# Altium project Relay_Board_V2.0.PrjPcb
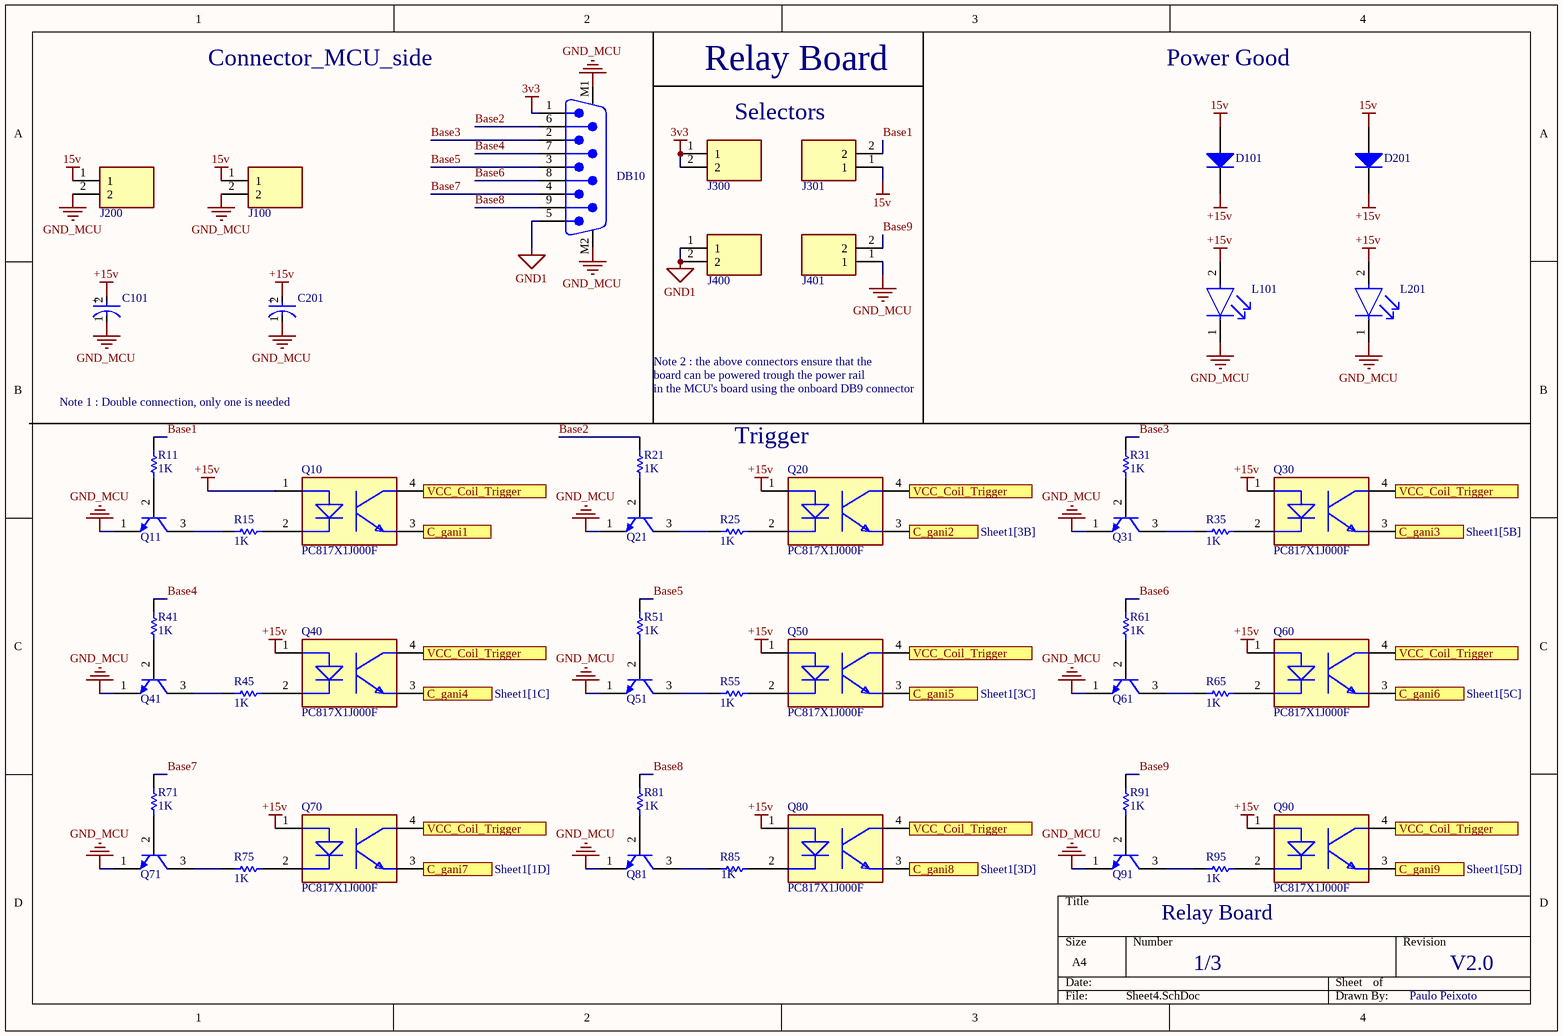
[diagram p0: Sheet4.SchDoc]
3 sheets, 136 parts. Net scope: flat (ports and power ports of the same name join across sheets).
Board file: PCB.PcbDoc
Sheets:
  Sheet4.SchDoc
  Sheet1.SchDoc
  Sheet2.SchDoc

## Sheet Sheet4.SchDoc
size A4; SheetNumber: 1; SheetTotal: 3

### Parts
C101  EEE-FK1H100UR  [FP-FKC-MFG]  (value not drawn)
C201  EEE-FK1H100UR  [FP-FKC-MFG]  (value not drawn)
D101  1N4001-T  [DIOD-DO-41-P-2_V]  (value not drawn)
D201  1N4001-T  [DIOD-DO-41-P-2_V]  (value not drawn)
DB10  618009231221  [618009231221]  (value not drawn)
J100  TB004-508-02BE  [Terminal_TH_2P_3.50]  (value not drawn)
J200  TB004-508-02BE  [Terminal_TH_2P_3.50]  (value not drawn)
J300  TB004-508-02BE  [HEADER_MALE_TH_2P_2.54]  (value not drawn)
J301  TB004-508-02BE  [HEADER_MALE_TH_2P_2.54]  (value not drawn)
J400  TB004-508-02BE  [HEADER_MALE_TH_2P_2.54]  (value not drawn)
J401  TB004-508-02BE  [HEADER_MALE_TH_2P_2.54]  (value not drawn)
L101  TLLG4400  [FP-6_544-5255_01-4-MFG]  (value not drawn)
L201  TLLG4400  [FP-6_544-5255_01-4-MFG]  (value not drawn)
Q10  PC817X1J000F  [FP-PC817X1J000F-MFG]
Q11  PN2222ATF  [FAIR-TO-92-3]  (value not drawn)
Q20  PC817X1J000F  [FP-PC817X1J000F-MFG]
Q21  PN2222ATF  [FAIR-TO-92-3]  (value not drawn)
Q30  PC817X1J000F  [FP-PC817X1J000F-MFG]
Q31  PN2222ATF  [FAIR-TO-92-3]  (value not drawn)
Q40  PC817X1J000F  [FP-PC817X1J000F-MFG]
Q41  PN2222ATF  [FAIR-TO-92-3]  (value not drawn)
Q50  PC817X1J000F  [FP-PC817X1J000F-MFG]
Q51  PN2222ATF  [FAIR-TO-92-3]  (value not drawn)
Q60  PC817X1J000F  [FP-PC817X1J000F-MFG]
Q61  PN2222ATF  [FAIR-TO-92-3]  (value not drawn)
Q70  PC817X1J000F  [FP-PC817X1J000F-MFG]
Q71  PN2222ATF  [FAIR-TO-92-3]  (value not drawn)
Q80  PC817X1J000F  [FP-PC817X1J000F-MFG]
Q81  PN2222ATF  [FAIR-TO-92-3]  (value not drawn)
Q90  PC817X1J000F  [FP-PC817X1J000F-MFG]
Q91  PN2222ATF  [FAIR-TO-92-3]  (value not drawn)
R11  1K  [RESC3216X70X50NL05T20]
R15  1K  [RESC3216X70X50NL05T20]
R21  1K  [RESC3216X70X50NL05T20]
R25  1K  [RESC3216X70X50NL05T20]
R31  1K  [RESC3216X70X50NL05T20]
R35  1K  [RESC3216X70X50NL05T20]
R41  1K  [RESC3216X70X50NL05T20]
R45  1K  [RESC3216X70X50NL05T20]
R51  1K  [RESC3216X70X50NL05T20]
R55  1K  [RESC3216X70X50NL05T20]
R61  1K  [RESC3216X70X50NL05T20]
R65  1K  [RESC3216X70X50NL05T20]
R71  1K  [RESC3216X70X50NL05T20]
R75  1K  [RESC3216X70X50NL05T20]
R81  1K  [RESC3216X70X50NL05T20]
R85  1K  [RESC3216X70X50NL05T20]
R91  1K  [RESC3216X70X50NL05T20]
R95  1K  [RESC3216X70X50NL05T20]

### Ports
C_gani1 (see Sheet1[1B]), C_gani2 (see Sheet1[3B]), C_gani3 (see Sheet1[5B]), C_gani4 (see Sheet1[1C]), C_gani5 (see Sheet1[3C]), C_gani6 (see Sheet1[5C]), C_gani7 (see Sheet1[1D]), C_gani8 (see Sheet1[3D]), C_gani9 (see Sheet1[5D]), VCC_Coil_Trigger (see Sheet1[1A], Sheet1[1C], Sheet1[1D], Sheet1[3A], Sheet1[3C], Sheet1[3D], Sheet1[5A], Sheet1[5C], Sheet1[5D], Sheet2[1A], Sheet2[2A], Sheet4[2B], Sheet4[2C], Sheet4[2D], Sheet4[3B], Sheet4[3C], Sheet4[3D], Sheet4[4B], Sheet4[4C]), VCC_Coil_Trigger (see Sheet1[1A], Sheet1[1C], Sheet1[1D], Sheet1[3A], Sheet1[3C], Sheet1[3D], Sheet1[5A], Sheet1[5C], Sheet1[5D], Sheet2[1A], Sheet2[2A], Sheet4[2B], Sheet4[2C], Sheet4[2D], Sheet4[3B], Sheet4[3C], Sheet4[3D], Sheet4[4B], Sheet4[4D]), VCC_Coil_Trigger (see Sheet1[1A], Sheet1[1C], Sheet1[1D], Sheet1[3A], Sheet1[3C], Sheet1[3D], Sheet1[5A], Sheet1[5C], Sheet1[5D], Sheet2[1A], Sheet2[2A], Sheet4[2B], Sheet4[2C], Sheet4[2D], Sheet4[3B], Sheet4[3C], Sheet4[3D], Sheet4[4C], Sheet4[4D]), VCC_Coil_Trigger (see Sheet1[1A], Sheet1[1C], Sheet1[1D], Sheet1[3A], Sheet1[3C], Sheet1[3D], Sheet1[5A], Sheet1[5C], Sheet1[5D], Sheet2[1A], Sheet2[2A], Sheet4[2B], Sheet4[2C], Sheet4[2D], Sheet4[3B], Sheet4[3C], Sheet4[4B], Sheet4[4C], Sheet4[4D]), VCC_Coil_Trigger (see Sheet1[1A], Sheet1[1C], Sheet1[1D], Sheet1[3A], Sheet1[3C], Sheet1[3D], Sheet1[5A], Sheet1[5C], Sheet1[5D], Sheet2[1A], Sheet2[2A], Sheet4[2B], Sheet4[2C], Sheet4[2D], Sheet4[3B], Sheet4[3D], Sheet4[4B], Sheet4[4C], Sheet4[4D]), VCC_Coil_Trigger (see Sheet1[1A], Sheet1[1C], Sheet1[1D], Sheet1[3A], Sheet1[3C], Sheet1[3D], Sheet1[5A], Sheet1[5C], Sheet1[5D], Sheet2[1A], Sheet2[2A], Sheet4[2B], Sheet4[2C], Sheet4[2D], Sheet4[3C], Sheet4[3D], Sheet4[4B], Sheet4[4C], Sheet4[4D]), VCC_Coil_Trigger (see Sheet1[1A], Sheet1[1C], Sheet1[1D], Sheet1[3A], Sheet1[3C], Sheet1[3D], Sheet1[5A], Sheet1[5C], Sheet1[5D], Sheet2[1A], Sheet2[2A], Sheet4[2B], Sheet4[2C], Sheet4[3B], Sheet4[3C], Sheet4[3D], Sheet4[4B], Sheet4[4C], Sheet4[4D]), VCC_Coil_Trigger (see Sheet1[1A], Sheet1[1C], Sheet1[1D], Sheet1[3A], Sheet1[3C], Sheet1[3D], Sheet1[5A], Sheet1[5C], Sheet1[5D], Sheet2[1A], Sheet2[2A], Sheet4[2B], Sheet4[2D], Sheet4[3B], Sheet4[3C], Sheet4[3D], Sheet4[4B], Sheet4[4C], Sheet4[4D]), VCC_Coil_Trigger (see Sheet1[1A], Sheet1[1C], Sheet1[1D], Sheet1[3A], Sheet1[3C], Sheet1[3D], Sheet1[5A], Sheet1[5C], Sheet1[5D], Sheet2[1A], Sheet2[2A], Sheet4[2C], Sheet4[2D], Sheet4[3B], Sheet4[3C], Sheet4[3D], Sheet4[4B], Sheet4[4C], Sheet4[4D])

### Nets
3v3: DB10.1 J300.1 J300.2
15v: D101.1(A) D201.1(A) J100.1 J200.1 J301.1
+15v: C101.2(A) C201.2(A) D101.2(K) D201.2(K) L101.2(A) L201.2(A) Q10.1(A) Q20.1(A) Q30.1(A) Q40.1(A) Q50.1(A) Q60.1(A) Q70.1(A) Q80.1(A) Q90.1(A)
GND1: DB10.5 J400.1 J400.2
GND_MCU: C101.1(C) C201.1(C) DB10.M1 DB10.M2 J100.2 J200.2 J401.1 L101.1(C) L201.1(C) Q11.1(E) Q21.1(E) Q31.1(E) Q41.1(E) Q51.1(E) Q61.1(E) Q71.1(E) Q81.1(E) Q91.1(E)
Base1: J301.2 R11.2
Base2: DB10.6 R21.2
Base3: DB10.2 R31.2
Base4: DB10.7 R41.2
Base5: DB10.3 R51.2
Base6: DB10.8 R61.2
Base7: DB10.4 R71.2
Base8: DB10.9 R81.2
Base9: J401.2 R91.2
NetC301_2: Q10.4(C) Q20.4(C) Q30.4(C) Q40.4(C) Q50.4(C) Q60.4(C) Q70.4(C) Q80.4(C) Q90.4(C) ; port VCC_Coil_Trigger
NetQ10_2: Q10.2(C) R15.1
NetQ10_3: Q10.3(E) ; port C_gani1
NetQ11_2: Q11.2(B) R11.1
NetQ11_3: Q11.3(C) R15.2
NetQ20_2: Q20.2(C) R25.1
NetQ20_3: Q20.3(E) ; port C_gani2
NetQ21_2: Q21.2(B) R21.1
NetQ21_3: Q21.3(C) R25.2
NetQ30_2: Q30.2(C) R35.1
NetQ30_3: Q30.3(E) ; port C_gani3
NetQ31_2: Q31.2(B) R31.1
NetQ31_3: Q31.3(C) R35.2
NetQ40_2: Q40.2(C) R45.1
NetQ40_3: Q40.3(E) ; port C_gani4
NetQ41_2: Q41.2(B) R41.1
NetQ41_3: Q41.3(C) R45.2
NetQ50_2: Q50.2(C) R55.1
NetQ50_3: Q50.3(E) ; port C_gani5
NetQ51_2: Q51.2(B) R51.1
NetQ51_3: Q51.3(C) R55.2
NetQ60_2: Q60.2(C) R65.1
NetQ60_3: Q60.3(E) ; port C_gani6
NetQ61_2: Q61.2(B) R61.1
NetQ61_3: Q61.3(C) R65.2
NetQ70_2: Q70.2(C) R75.1
NetQ70_3: Q70.3(E) ; port C_gani7
NetQ71_2: Q71.2(B) R71.1
NetQ71_3: Q71.3(C) R75.2
NetQ80_2: Q80.2(C) R85.1
NetQ80_3: Q80.3(E) ; port C_gani8
NetQ81_2: Q81.2(B) R81.1
NetQ81_3: Q81.3(C) R85.2
NetQ90_2: Q90.2(C) R95.1
NetQ90_3: Q90.3(E) ; port C_gani9
NetQ91_2: Q91.2(B) R91.1
NetQ91_3: Q91.3(C) R95.2

### Notes on the sheet
- Connector_MCU_side
- Relay Board
- Power Good
- Selectors
- Note 2 : the above connectors ensure that the
- board can be powered trough the power rail
- (near R11) Note 1 : Double connection, only one is needed
- in the MCU's board using the onboard DB9 connector
- (near Q20) Trigger
- 1/3
- V2.0
- Paulo Peixoto
- (in symbol CMP-05427-000030-1) +

### Library data of the parts
C101 C201 = CMP-05427-000030-1: CAP ALUM 10UF 20% 50V SMD; Impedance: 1.52R; Ripple Current (AC): 85mA; Life (Hours): 2000Hour; Leakage Current: 3uA; Dielectric Material: Aluminium; Length: 5.8mm; Voltage Rating: 50V; Radiation Hardening: No; Max Operating Temperature: 105°C; REACH SVHC: No SVHC; Tolerance: 20%; RoHS Compliant: Yes; Case/Package: Radial; Height: 5.8mm; Voltage: 50V; Diameter: 5mm; Number of Pins: 2; Ripple Current: 85mA; Series: FK; Lead Free: Lead Free; Width: 6.5mm; ESR (Equivalent Series Resistance): 1.52R; Package Quantity: 1000; Construction: Cylindrical; Voltage Rating (DC): 50V; Packaging: Tape and Reel; Height - Seated (Max): 0.228inch; Contact Plating: Tin; Capacitance: 10uF; Min Operating Temperature: -55°C; Termination: SMD/SMT; Material: Aluminium; Mount: Surface Mount
D101 D201 = CMP-0639-00006-2: 1.0 A Rectifier, 15 pF, 50 V, -65 to 150 degC, 2-Pin DO-41 Plastic, RoHS, Tape and Reel; Manufacturer: Diodes Inc; VF (V): 1; CT (pF): 15; Max. IR (uA): 5; VRRM (V): 50; Max. IFSM (A): 30; RoHS: TRUE; Mounting Technology: Through Hole; PartNumber: 1N4001-T; ComponentLink2Description: Datasheet; DatasheetVersion: Rev. 8-2; Operating Temperature Range (degC): -65 to 150; Packing: Tape and Reel; PackageReference: DO-41-P-2; ComponentLink1URL: http://diodes.com/; PackageDescription: 2-Pin Axial Lead, Body 4.635 x 2.36 mm, Lead Spread 25.4 mm; ComponentLink2URL: http://diodes.com/datasheets/ds28002.pdf; Max. Average Rectified Current IO (A): 1; ComponentLink1Description: Manufacturer URL
DB10 = CMP-1502-00284-2: NexarPartId: 22865742; Pitch: 2.77mm; Number of Contacts: 9; Operating Supply Voltage: 125V; Insulation Resistance: 5GΩ; Gender: Male; Contact Resistance: 30mΩ; Current Rating: 3A; Mount: Through Hole; Housing Material: Steel; Contact Plating: Gold; Width: 12.5mm; Insulation Material: PBT; RoHS: Compliant; Depth: 18.5mm; Contact Material: Gold; Max Operating Temperature: 105°C; Min Operating Temperature: -55°C; Termination: SMD/SMT; Height: 12.7mm; Voltage Rating: 125V; Length: 30.8mm; Orientation: Right Angle; Number of Rows: 2; Number of Pins: 9; REACH SVHC: Unknown
J100 J200 = Con_Terminal_2P: Connector; Manufacturer_Name: CUI Devices; Datasheet Link: https://componentsearchengine.com/Datasheets/1/TB004-508-02BE.pdf; Height: 14.1mm; Manufacturer_Part_Number: TB004-508-02BE; Arrow Part Number: TB004-508-02BE; Arrow Price/Stock: https://www.arrow.com/en/products/tb004-508-02be/cui-inc; Mouser Part Number: 490-TB004-508-02BE; Mouser Price/Stock: https://www.mouser.co.uk/ProductDetail/CUI-Devices/TB004-508-02BE?qs=vLWxofP3U2zLwdGzG2tSkA%3D%3D
J300 J301 J400 J401 = Con_Header_2P: Connector; Manufacturer_Name: CUI Devices; Datasheet Link: https://componentsearchengine.com/Datasheets/1/TB004-508-02BE.pdf; Height: 14.1mm; Manufacturer_Part_Number: TB004-508-02BE; Arrow Part Number: TB004-508-02BE; Arrow Price/Stock: https://www.arrow.com/en/products/tb004-508-02be/cui-inc; Mouser Part Number: 490-TB004-508-02BE; Mouser Price/Stock: https://www.mouser.co.uk/ProductDetail/CUI-Devices/TB004-508-02BE?qs=vLWxofP3U2zLwdGzG2tSkA%3D%3D
L101 L201 = CMP-00030-55433990-1: TLLG4400 Led, Pcb, Green, 0.63MCD, 3MM, T-1, 7MA, 1.9V, 565NM, 25DEG, 20V, 20MW, -40; Lens Transparency: Diffused; Dominant Wavelength: 575nm; Test Current: 2mA; Viewing Angle: 50°; Lens Style: Circular, Colored, Diffused, Dome, Round; Number of LEDs: 1; Voltage Rating (DC): 2.4V; Luminous Intensity: 1.2mcd; Depth: 3.2mm; Wavelength: 575nm; Color: Green; Schedule B: 8541402000, 8541402000; RoHS: Compliant; Max Operating Temperature: 100°C; Power Dissipation: 20mW; Height: 4.5mm; Number of Pins: 2; Forward Voltage: 1.9V; NexarPartId: 55433990; Max Power Dissipation: 20mW; Length: 3.2mm; Forward Current: 2mA; Min Operating Temperature: -40°C; Illumination Color: Green; Lens Size: 3mm; Reverse Voltage: 20V; Mount: Through Hole; Case/Package: T; Radiation Hardening: No; Number of Elements: 1; REACH SVHC: Unknown; Lens Color: Green
Q10 Q20 Q30 Q40 Q50 Q60 Q70 Q80 Q90 = CMP-65434-000003-1: OPTOISOLATOR 5KV TRANS 4DIP; Collector Emitter Saturation Voltage: 200mV; Forward Voltage: 1.4V; Power Dissipation: 200mW; Input Current: 20mA; Max Collector Current: 50mA; Collector Emitter Breakdown Voltage: 80V; Rise Time: 18000ns; Number of Elements: 1; Reverse Breakdown Voltage: 6V; Current Transfer Ratio: 600%; Min Operating Temperature: -30°C; Number of Pins: 4; Radiation Hardening: No; Output Current per Channel: 50mA; Case/Package: DIP; Fall Time: 18000ns; Forward Current: 50mA; Isolation Voltage: 5kV; Package Quantity: 2000; Max Operating Temperature: 100°C; Packaging: Sleeve; Max Input Current: 50mA; Output Voltage: 80V; Max Power Dissipation: 200mW; Mount: Through Hole; Number of Channels: 1; Collector Emitter Voltage (VCEO): 80V
Q11 Q21 Q31 Q41 Q51 Q61 Q71 Q81 Q91 = CMP-2000-06911-1: NPN General-Purpose Amplifier, 40 V, -55 to 150 degC, 3-Pin TO-92, RoHS, Tape and Reel; Manufacturer: FairchildSemiconductor; Configuration: Single; Collector-Emitter Saturation Voltage: 1V; Collector- Emitter Voltage VCEO Max: 40V; Unit Weight: 0.008466oz; Maximum DC Collector Current: 1A; DC Collector/Base Gain hfe Min: 100; Emitter- Base Voltage VEBO: 6V; Maximum Power Dissipation: 625mW; DC Current Gain hFE Max: 300; Gain Bandwidth Product fT: 300MHz; Collector- Base Voltage VCBO: 75V; Mounting Style: ThroughHole; Package Description: 3-Pin Transistor Outline Package, Body Dia 4.79 mm, Pitch 2.6 mm; Mounting Technology: ThroughHole; RoHS: Details; Brand: FairchildSemiconductor; Minimum Operating Temperature: -55C; Package / Case: TO-92-3KinkedLead; Package Reference: TO-92; Series: PN2222; Packaging: Reel; Datasheet Version: Rev. 1.1.0, 07/2014; Datasheet URL: https://www.fairchildsemi.com/datasheets/PN/PN2222A.pdf; Maximum Operating Temperature: +150C; Transistor Polarity: NPN; Factory Pack Quantity: 2000; Manufacturer URL: https://www.fairchildsemi.com/; <PCN>: http://www.mouser.com/PCN/3.26.10LTBDFairchild.pdf; Product Category: BipolarTransistors-BJT
R11 R15 R21 R25 R31 R35 R41 R45 R51 R55 R61 R65 R71 R75 R81 R85 R91 R95 = CMP-2003-00541-1: Manufacturer: Panasonic; Part Number: ERJ-8GEY0R00V

## Sheet Sheet1.SchDoc
size B; SheetNumber: 2; SheetTotal: 3
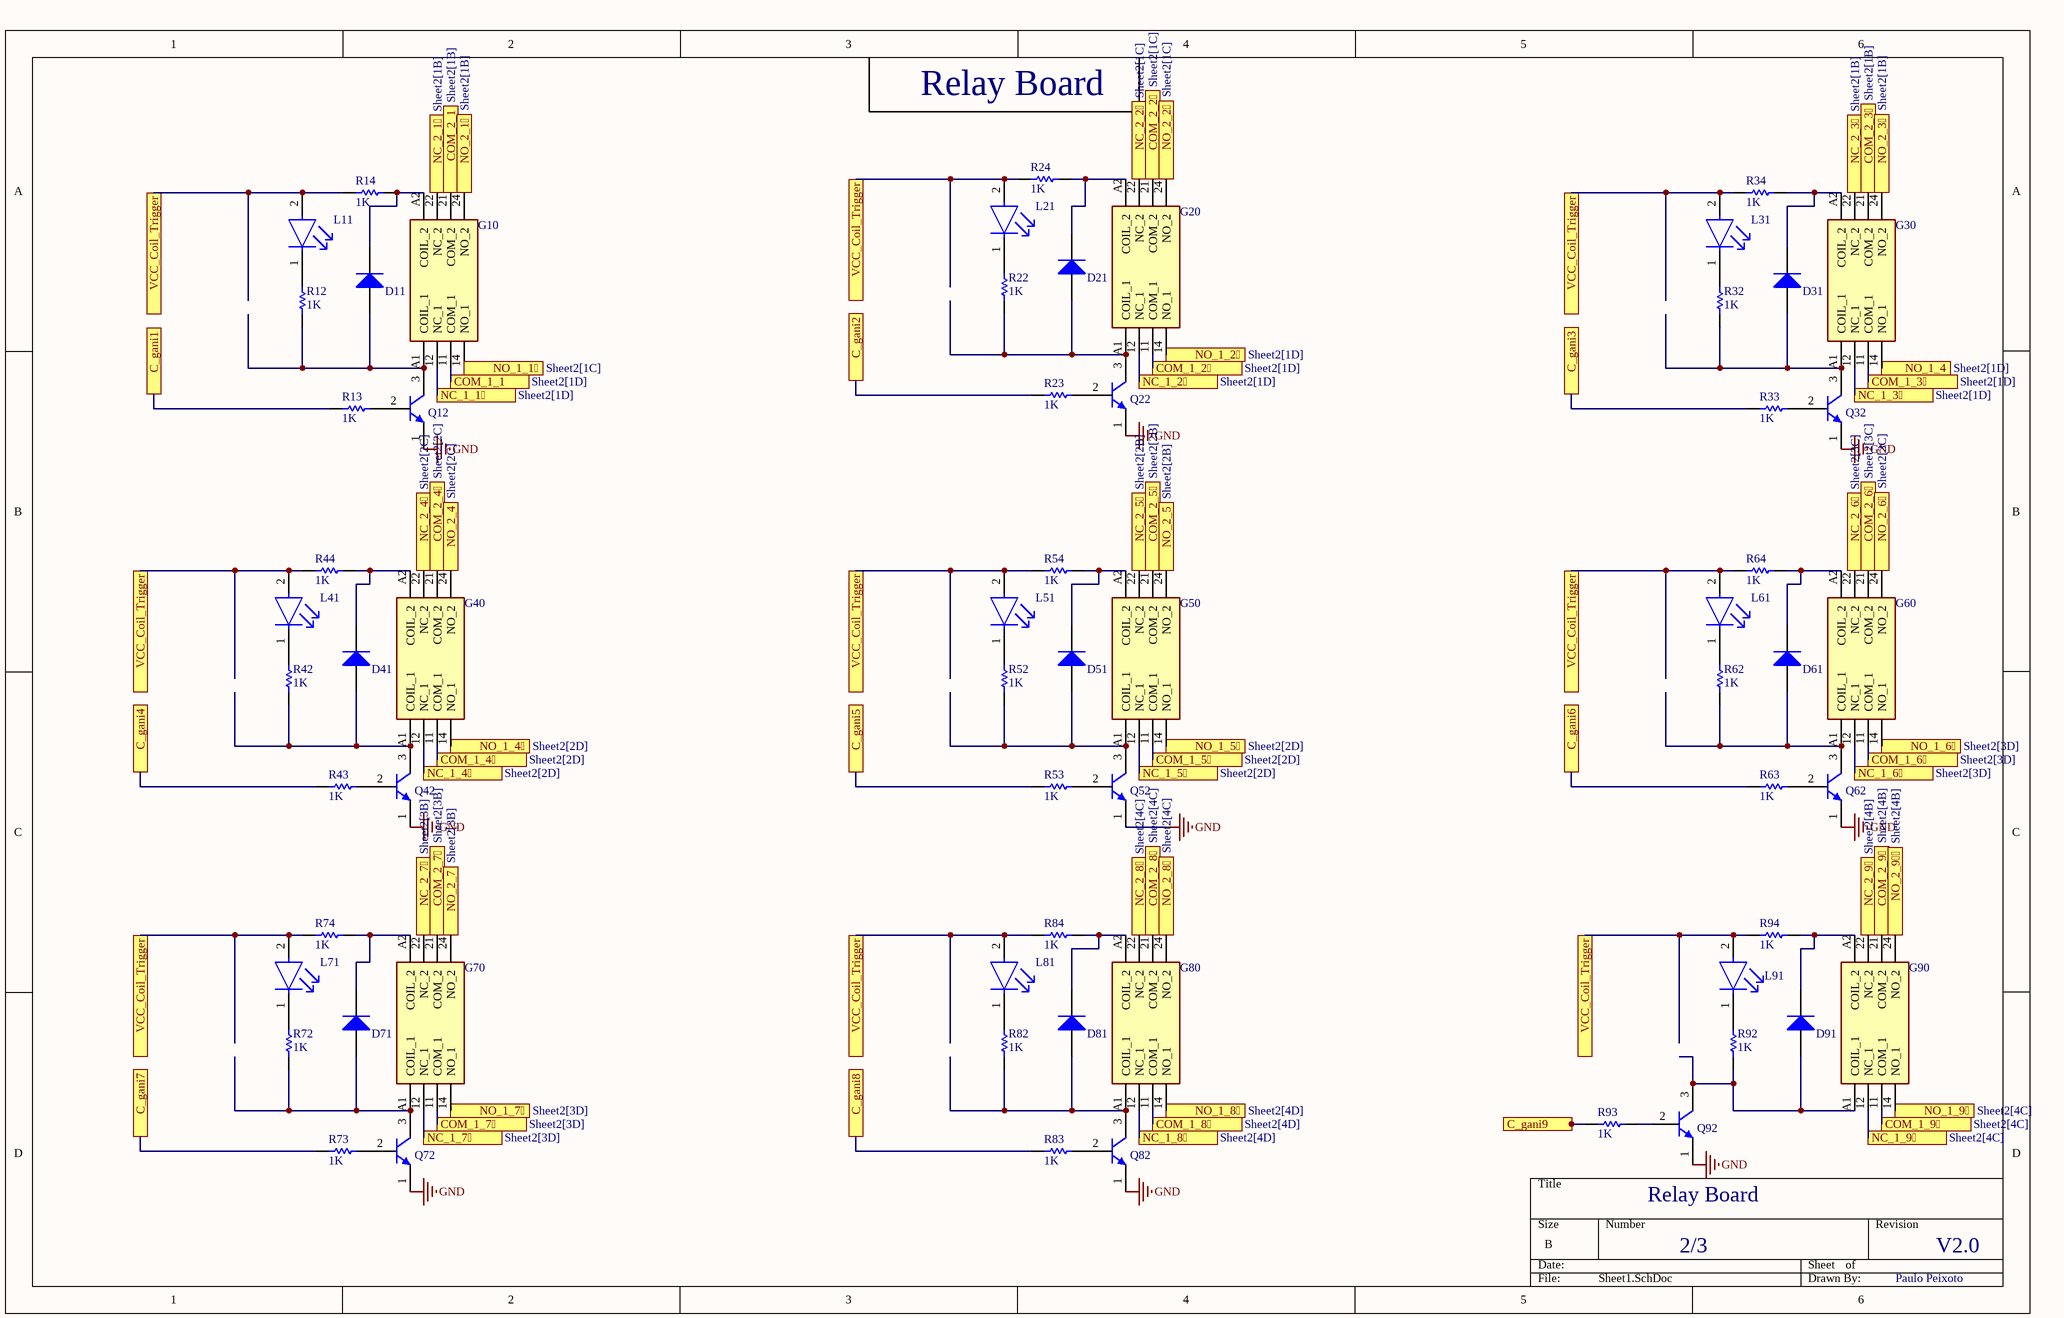
[diagram p1: Sheet1.SchDoc]

### Parts
D11  1N4001-T  [DIOD-DO-41-P-2_V]  (value not drawn)
D21  1N4001-T  [DIOD-DO-41-P-2_V]  (value not drawn)
D31  1N4001-T  [DIOD-DO-41-P-2_V]  (value not drawn)
D41  1N4001-T  [DIOD-DO-41-P-2_V]  (value not drawn)
D51  1N4001-T  [DIOD-DO-41-P-2_V]  (value not drawn)
D61  1N4001-T  [DIOD-DO-41-P-2_V]  (value not drawn)
D71  1N4001-T  [DIOD-DO-41-P-2_V]  (value not drawn)
D81  1N4001-T  [DIOD-DO-41-P-2_V]  (value not drawn)
D91  1N4001-T  [DIOD-DO-41-P-2_V]  (value not drawn)
G10  40.52.9.012.0000  [405290120000]  (value not drawn)
G20  40.52.9.012.0000  [405290120000]  (value not drawn)
G30  40.52.9.012.0000  [405290120000]  (value not drawn)
G40  40.52.9.012.0000  [405290120000]  (value not drawn)
G50  40.52.9.012.0000  [405290120000]  (value not drawn)
G60  40.52.9.012.0000  [405290120000]  (value not drawn)
G70  40.52.9.012.0000  [405290120000]  (value not drawn)
G80  40.52.9.012.0000  [405290120000]  (value not drawn)
G90  40.52.9.012.0000  [405290120000]  (value not drawn)
L11  TLLG4400  [FP-6_544-5255_01-4-MFG]  (value not drawn)
L21  TLLG4400  [FP-6_544-5255_01-4-MFG]  (value not drawn)
L31  TLLG4400  [FP-6_544-5255_01-4-MFG]  (value not drawn)
L41  TLLG4400  [FP-6_544-5255_01-4-MFG]  (value not drawn)
L51  TLLG4400  [FP-6_544-5255_01-4-MFG]  (value not drawn)
L61  TLLG4400  [FP-6_544-5255_01-4-MFG]  (value not drawn)
L71  TLLG4400  [FP-6_544-5255_01-4-MFG]  (value not drawn)
L81  TLLG4400  [FP-6_544-5255_01-4-MFG]  (value not drawn)
L91  TLLG4400  [FP-6_544-5255_01-4-MFG]  (value not drawn)
Q12  PN2222ATF  [FAIR-TO-92-3]  (value not drawn)
Q22  PN2222ATF  [FAIR-TO-92-3]  (value not drawn)
Q32  PN2222ATF  [FAIR-TO-92-3]  (value not drawn)
Q42  PN2222ATF  [FAIR-TO-92-3]  (value not drawn)
Q52  PN2222ATF  [FAIR-TO-92-3]  (value not drawn)
Q62  PN2222ATF  [FAIR-TO-92-3]  (value not drawn)
Q72  PN2222ATF  [FAIR-TO-92-3]  (value not drawn)
Q82  PN2222ATF  [FAIR-TO-92-3]  (value not drawn)
Q92  PN2222ATF  [FAIR-TO-92-3]  (value not drawn)
R12  1K  [RESC3216X70X50NL05T20]
R13  1K  [RESC3216X70X50NL05T20]
R14  1K  [RESC3216X70X50NL05T20]
R22  1K  [RESC3216X70X50NL05T20]
R23  1K  [RESC3216X70X50NL05T20]
R24  1K  [RESC3216X70X50NL05T20]
R32  1K  [RESC3216X70X50NL05T20]
R33  1K  [RESC3216X70X50NL05T20]
R34  1K  [RESC3216X70X50NL05T20]
R42  1K  [RESC3216X70X50NL05T20]
R43  1K  [RESC3216X70X50NL05T20]
R44  1K  [RESC3216X70X50NL05T20]
R52  1K  [RESC3216X70X50NL05T20]
R53  1K  [RESC3216X70X50NL05T20]
R54  1K  [RESC3216X70X50NL05T20]
R62  1K  [RESC3216X70X50NL05T20]
R63  1K  [RESC3216X70X50NL05T20]
R64  1K  [RESC3216X70X50NL05T20]
R72  1K  [RESC3216X70X50NL05T20]
R73  1K  [RESC3216X70X50NL05T20]
R74  1K  [RESC3216X70X50NL05T20]
R82  1K  [RESC3216X70X50NL05T20]
R83  1K  [RESC3216X70X50NL05T20]
R84  1K  [RESC3216X70X50NL05T20]
R92  1K  [RESC3216X70X50NL05T20]
R93  1K  [RESC3216X70X50NL05T20]
R94  1K  [RESC3216X70X50NL05T20]

### Ports
C_gani1 (see Sheet4[2C]), C_gani2 (see Sheet4[3C]), C_gani3 (see Sheet4[4C]), C_gani4 (see Sheet4[2C]), C_gani5 (see Sheet4[3C]), C_gani6 (see Sheet4[4C]), C_gani7 (see Sheet4[2D]), C_gani8 (see Sheet4[3D]), C_gani9 (see Sheet4[4D]), COM_1_1 (see Sheet2[1D]), COM_1_2 (see Sheet2[1D]), COM_1_3 (see Sheet2[1D]), COM_1_4 (see Sheet2[2D]), COM_1_5 (see Sheet2[2D]), COM_1_6 (see Sheet2[3D]), COM_1_7 (see Sheet2[3D]), COM_1_8 (see Sheet2[4D]), COM_1_9 (see Sheet2[4C]), COM_2_1 (see Sheet2[1B]), COM_2_2 (see Sheet2[1C]), COM_2_3 (see Sheet2[1B]), COM_2_4 (see Sheet2[2C]), COM_2_5 (see Sheet2[2B]), COM_2_6 (see Sheet2[3C]), COM_2_7 (see Sheet2[3B]), COM_2_8 (see Sheet2[4C]), COM_2_9 (see Sheet2[4B]), NC_1_1 (see Sheet2[1D]), NC_1_2 (see Sheet2[1D]), NC_1_3 (see Sheet2[1D]), NC_1_4 (see Sheet2[2D]), NC_1_5 (see Sheet2[2D]), NC_1_6 (see Sheet2[3D]), NC_1_7 (see Sheet2[3D]), NC_1_8 (see Sheet2[4D]), NC_1_9 (see Sheet2[4C]), NC_2_1 (see Sheet2[1B]), NC_2_2 (see Sheet2[1C]), NC_2_3 (see Sheet2[1B]), NC_2_4 (see Sheet2[2C]), NC_2_5 (see Sheet2[2B]), NC_2_6 (see Sheet2[3C]), NC_2_7 (see Sheet2[3B]), NC_2_8 (see Sheet2[4C]), NC_2_9 (see Sheet2[4B]), NO_1_1 (see Sheet2[1C]), NO_1_2 (see Sheet2[1D]), NO_1_4 (see Sheet2[2D]), NO_1_4 (see Sheet2[1D]), NO_1_5 (see Sheet2[2D]), NO_1_6 (see Sheet2[3D]), NO_1_7 (see Sheet2[3D]), NO_1_8 (see Sheet2[4D]), NO_1_9 (see Sheet2[4C]), NO_2_1 (see Sheet2[1B]), NO_2_2 (see Sheet2[1C]), NO_2_3 (see Sheet2[1B]), NO_2_4 (see Sheet2[2C]), NO_2_5 (see Sheet2[2B]), NO_2_6 (see Sheet2[3C]), NO_2_7 (see Sheet2[3B]), NO_2_8 (see Sheet2[4C]), NO_2_9 (see Sheet2[4B]), VCC_Coil_Trigger (see Sheet1[1A], Sheet1[1C], Sheet1[1D], Sheet1[3A], Sheet1[3C], Sheet1[3D], Sheet1[5A], Sheet1[5C], Sheet2[1A], Sheet2[2A], Sheet4[2B], Sheet4[2C], Sheet4[2D], Sheet4[3B], Sheet4[3C], Sheet4[3D], Sheet4[4B], Sheet4[4C], Sheet4[4D]), VCC_Coil_Trigger (see Sheet1[1A], Sheet1[1C], Sheet1[1D], Sheet1[3A], Sheet1[3C], Sheet1[3D], Sheet1[5A], Sheet1[5D], Sheet2[1A], Sheet2[2A], Sheet4[2B], Sheet4[2C], Sheet4[2D], Sheet4[3B], Sheet4[3C], Sheet4[3D], Sheet4[4B], Sheet4[4C], Sheet4[4D]), VCC_Coil_Trigger (see Sheet1[1A], Sheet1[1C], Sheet1[1D], Sheet1[3A], Sheet1[3C], Sheet1[3D], Sheet1[5C], Sheet1[5D], Sheet2[1A], Sheet2[2A], Sheet4[2B], Sheet4[2C], Sheet4[2D], Sheet4[3B], Sheet4[3C], Sheet4[3D], Sheet4[4B], Sheet4[4C], Sheet4[4D]), VCC_Coil_Trigger (see Sheet1[1A], Sheet1[1C], Sheet1[1D], Sheet1[3A], Sheet1[3C], Sheet1[5A], Sheet1[5C], Sheet1[5D], Sheet2[1A], Sheet2[2A], Sheet4[2B], Sheet4[2C], Sheet4[2D], Sheet4[3B], Sheet4[3C], Sheet4[3D], Sheet4[4B], Sheet4[4C], Sheet4[4D]), VCC_Coil_Trigger (see Sheet1[1A], Sheet1[1C], Sheet1[1D], Sheet1[3A], Sheet1[3D], Sheet1[5A], Sheet1[5C], Sheet1[5D], Sheet2[1A], Sheet2[2A], Sheet4[2B], Sheet4[2C], Sheet4[2D], Sheet4[3B], Sheet4[3C], Sheet4[3D], Sheet4[4B], Sheet4[4C], Sheet4[4D]), VCC_Coil_Trigger (see Sheet1[1A], Sheet1[1C], Sheet1[1D], Sheet1[3C], Sheet1[3D], Sheet1[5A], Sheet1[5C], Sheet1[5D], Sheet2[1A], Sheet2[2A], Sheet4[2B], Sheet4[2C], Sheet4[2D], Sheet4[3B], Sheet4[3C], Sheet4[3D], Sheet4[4B], Sheet4[4C], Sheet4[4D]), VCC_Coil_Trigger (see Sheet1[1A], Sheet1[1C], Sheet1[3A], Sheet1[3C], Sheet1[3D], Sheet1[5A], Sheet1[5C], Sheet1[5D], Sheet2[1A], Sheet2[2A], Sheet4[2B], Sheet4[2C], Sheet4[2D], Sheet4[3B], Sheet4[3C], Sheet4[3D], Sheet4[4B], Sheet4[4C], Sheet4[4D]), VCC_Coil_Trigger (see Sheet1[1A], Sheet1[1D], Sheet1[3A], Sheet1[3C], Sheet1[3D], Sheet1[5A], Sheet1[5C], Sheet1[5D], Sheet2[1A], Sheet2[2A], Sheet4[2B], Sheet4[2C], Sheet4[2D], Sheet4[3B], Sheet4[3C], Sheet4[3D], Sheet4[4B], Sheet4[4C], Sheet4[4D]), VCC_Coil_Trigger (see Sheet1[1C], Sheet1[1D], Sheet1[3A], Sheet1[3C], Sheet1[3D], Sheet1[5A], Sheet1[5C], Sheet1[5D], Sheet2[1A], Sheet2[2A], Sheet4[2B], Sheet4[2C], Sheet4[2D], Sheet4[3B], Sheet4[3C], Sheet4[3D], Sheet4[4B], Sheet4[4C], Sheet4[4D])

### Nets
GND: Q12.1(E) Q22.1(E) Q32.1(E) Q42.1(E) Q52.1(E) Q62.1(E) Q72.1(E) Q82.1(E) Q92.1(E)
NetC301_2: L11.2(A) L21.2(A) L31.2(A) L41.2(A) L51.2(A) L61.2(A) L71.2(A) L81.2(A) L91.2(A) R14.1 R24.1 R34.1 R44.1 R54.1 R64.1 R74.1 R84.1 R94.1 ; port VCC_Coil_Trigger
NetD11_1: D11.1(A) G10.A1(COIL_1) Q12.3(C) R12.1
NetD11_2: D11.2(K) G10.A2(COIL_2) R14.2
NetD21_1: D21.1(A) G20.A1(COIL_1) Q22.3(C) R22.1
NetD21_2: D21.2(K) G20.A2(COIL_2) R24.2
NetD31_1: D31.1(A) G30.A1(COIL_1) Q32.3(C) R32.1
NetD31_2: D31.2(K) G30.A2(COIL_2) R34.2
NetD41_1: D41.1(A) G40.A1(COIL_1) Q42.3(C) R42.1
NetD41_2: D41.2(K) G40.A2(COIL_2) R44.2
NetD51_1: D51.1(A) G50.A1(COIL_1) Q52.3(C) R52.1
NetD51_2: D51.2(K) G50.A2(COIL_2) R54.2
NetD61_1: D61.1(A) G60.A1(COIL_1) Q62.3(C) R62.1
NetD61_2: D61.2(K) G60.A2(COIL_2) R64.2
NetD71_1: D71.1(A) G70.A1(COIL_1) Q72.3(C) R72.1
NetD71_2: D71.2(K) G70.A2(COIL_2) R74.2
NetD81_1: D81.1(A) G80.A1(COIL_1) Q82.3(C) R82.1
NetD81_2: D81.2(K) G80.A2(COIL_2) R84.2
NetD91_1: D91.1(A) G90.A1(COIL_1) Q92.3(C) R92.1
NetD91_2: D91.2(K) G90.A2(COIL_2) R94.2
NetG10_11: G10.11(COM_1) ; port COM_1_1
NetG10_12: G10.12(NC_1) ; port NC_1_1
NetG10_14: G10.14(NO_1) ; port NO_1_1
NetG10_21: G10.21(COM_2) ; port COM_2_1
NetG10_22: G10.22(NC_2) ; port NC_2_1
NetG10_24: G10.24(NO_2) ; port NO_2_1
NetG20_11: G20.11(COM_1) ; port COM_1_2
NetG20_12: G20.12(NC_1) ; port NC_1_2
NetG20_14: G20.14(NO_1) ; port NO_1_2
NetG20_21: G20.21(COM_2) ; port COM_2_2
NetG20_22: G20.22(NC_2) ; port NC_2_2
NetG20_24: G20.24(NO_2) ; port NO_2_2
NetG30_11: G30.11(COM_1) ; port COM_1_3
NetG30_12: G30.12(NC_1) ; port NC_1_3
NetG30_14: G30.14(NO_1) ; port NO_1_4
NetG30_21: G30.21(COM_2) ; port COM_2_3
NetG30_22: G30.22(NC_2) ; port NC_2_3
NetG30_24: G30.24(NO_2) ; port NO_2_3
NetG40_11: G40.11(COM_1) ; port COM_1_4
NetG40_12: G40.12(NC_1) ; port NC_1_4
NetG40_14: G40.14(NO_1) ; port NO_1_4
NetG40_21: G40.21(COM_2) ; port COM_2_4
NetG40_22: G40.22(NC_2) ; port NC_2_4
NetG40_24: G40.24(NO_2) ; port NO_2_4
NetG50_11: G50.11(COM_1) ; port COM_1_5
NetG50_12: G50.12(NC_1) ; port NC_1_5
NetG50_14: G50.14(NO_1) ; port NO_1_5
NetG50_21: G50.21(COM_2) ; port COM_2_5
NetG50_22: G50.22(NC_2) ; port NC_2_5
NetG50_24: G50.24(NO_2) ; port NO_2_5
NetG60_11: G60.11(COM_1) ; port COM_1_6
NetG60_12: G60.12(NC_1) ; port NC_1_6
NetG60_14: G60.14(NO_1) ; port NO_1_6
NetG60_21: G60.21(COM_2) ; port COM_2_6
NetG60_22: G60.22(NC_2) ; port NC_2_6
NetG60_24: G60.24(NO_2) ; port NO_2_6
NetG70_11: G70.11(COM_1) ; port COM_1_7
NetG70_12: G70.12(NC_1) ; port NC_1_7
NetG70_14: G70.14(NO_1) ; port NO_1_7
NetG70_21: G70.21(COM_2) ; port COM_2_7
NetG70_22: G70.22(NC_2) ; port NC_2_7
NetG70_24: G70.24(NO_2) ; port NO_2_7
NetG80_11: G80.11(COM_1) ; port COM_1_8
NetG80_12: G80.12(NC_1) ; port NC_1_8
NetG80_14: G80.14(NO_1) ; port NO_1_8
NetG80_21: G80.21(COM_2) ; port COM_2_8
NetG80_22: G80.22(NC_2) ; port NC_2_8
NetG80_24: G80.24(NO_2) ; port NO_2_8
NetG90_11: G90.11(COM_1) ; port COM_1_9
NetG90_12: G90.12(NC_1) ; port NC_1_9
NetG90_14: G90.14(NO_1) ; port NO_1_9
NetG90_21: G90.21(COM_2) ; port COM_2_9
NetG90_22: G90.22(NC_2) ; port NC_2_9
NetG90_24: G90.24(NO_2) ; port NO_2_9
NetL11_1: L11.1(C) R12.2
NetL21_1: L21.1(C) R22.2
NetL31_1: L31.1(C) R32.2
NetL41_1: L41.1(C) R42.2
NetL51_1: L51.1(C) R52.2
NetL61_1: L61.1(C) R62.2
NetL71_1: L71.1(C) R72.2
NetL81_1: L81.1(C) R82.2
NetL91_1: L91.1(C) R92.2
NetQ10_3: R13.2 ; port C_gani1
NetQ12_2: Q12.2(B) R13.1
NetQ20_3: R23.2 ; port C_gani2
NetQ22_2: Q22.2(B) R23.1
NetQ30_3: R33.2 ; port C_gani3
NetQ32_2: Q32.2(B) R33.1
NetQ40_3: R43.2 ; port C_gani4
NetQ42_2: Q42.2(B) R43.1
NetQ50_3: R53.2 ; port C_gani5
NetQ52_2: Q52.2(B) R53.1
NetQ60_3: R63.2 ; port C_gani6
NetQ62_2: Q62.2(B) R63.1
NetQ70_3: R73.2 ; port C_gani7
NetQ72_2: Q72.2(B) R73.1
NetQ80_3: R83.2 ; port C_gani8
NetQ82_2: Q82.2(B) R83.1
NetQ90_3: R93.2 ; port C_gani9
NetQ92_2: Q92.2(B) R93.1

### Notes on the sheet
- Relay Board
- 2/3
- V2.0
- Paulo Peixoto

### Library data of the parts
D11 D21 D31 D41 D51 D61 D71 D81 D91 = CMP-0639-00006-2: as D101 on sheet Sheet4; RoHS: TRUE; Mounting Technology: Through Hole; PartNumber: 1N4001-T; ComponentLink2Description: Datasheet; DatasheetVersion: Rev. 8-2; Operating Temperature Range (degC): -65 to 150; Packing: Tape and Reel; PackageReference: DO-41-P-2; ComponentLink1URL: http://diodes.com/; PackageDescription: 2-Pin Axial Lead, Body 4.635 x 2.36 mm, Lead Spread 25.4 mm; ComponentLink2URL: http://diodes.com/datasheets/ds28002.pdf; Max. Average Rectified Current IO (A): 1; ComponentLink1Description: Manufacturer URL
G10 G20 G30 G40 G50 G60 G70 G80 G90 = Relay 40.52.9.012.0000: Relay or Contactor; Manufacturer_Name: FINDER; Datasheet Link: http://uk.rs-online.com/web/p/products/1829776; Height: 25mm; Manufacturer_Part_Number: 40.52.9.012.0000
L11 L21 L31 L41 L51 L61 L71 L81 L91 = CMP-00030-55433990-1: as L101 on sheet Sheet4; Depth: 3.2mm; Wavelength: 575nm; Color: Green; Schedule B: 8541402000, 8541402000; RoHS: Compliant; Max Operating Temperature: 100°C; Power Dissipation: 20mW; Height: 4.5mm; Number of Pins: 2; Forward Voltage: 1.9V; NexarPartId: 55433990; Max Power Dissipation: 20mW; Length: 3.2mm; Forward Current: 2mA; Min Operating Temperature: -40°C; Illumination Color: Green; Lens Size: 3mm; Reverse Voltage: 20V; Mount: Through Hole; Case/Package: T; Radiation Hardening: No; Number of Elements: 1; REACH SVHC: Unknown; Lens Color: Green
Q12 Q22 Q32 Q42 Q52 Q62 Q72 Q82 Q92 = CMP-2000-06911-1: as Q11 on sheet Sheet4; Mounting Style: ThroughHole; Package Description: 3-Pin Transistor Outline Package, Body Dia 4.79 mm, Pitch 2.6 mm; Mounting Technology: ThroughHole; RoHS: Details; Brand: FairchildSemiconductor; Minimum Operating Temperature: -55C; Package / Case: TO-92-3KinkedLead; Package Reference: TO-92; Series: PN2222; Packaging: Reel; Datasheet Version: Rev. 1.1.0, 07/2014; Datasheet URL: https://www.fairchildsemi.com/datasheets/PN/PN2222A.pdf; Maximum Operating Temperature: +150C; Transistor Polarity: NPN; Factory Pack Quantity: 2000; Manufacturer URL: https://www.fairchildsemi.com/; <PCN>: http://www.mouser.com/PCN/3.26.10LTBDFairchild.pdf; Product Category: BipolarTransistors-BJT
R12-R14 R22-R24 R32-R34 R42-R44 R52-R54 R62-R64 R72-R74 R82-R84 R92-R94 = CMP-2003-00541-1: as R11 on sheet Sheet4

## Sheet Sheet2.SchDoc
size A4; SheetNumber: 3; SheetTotal: 3
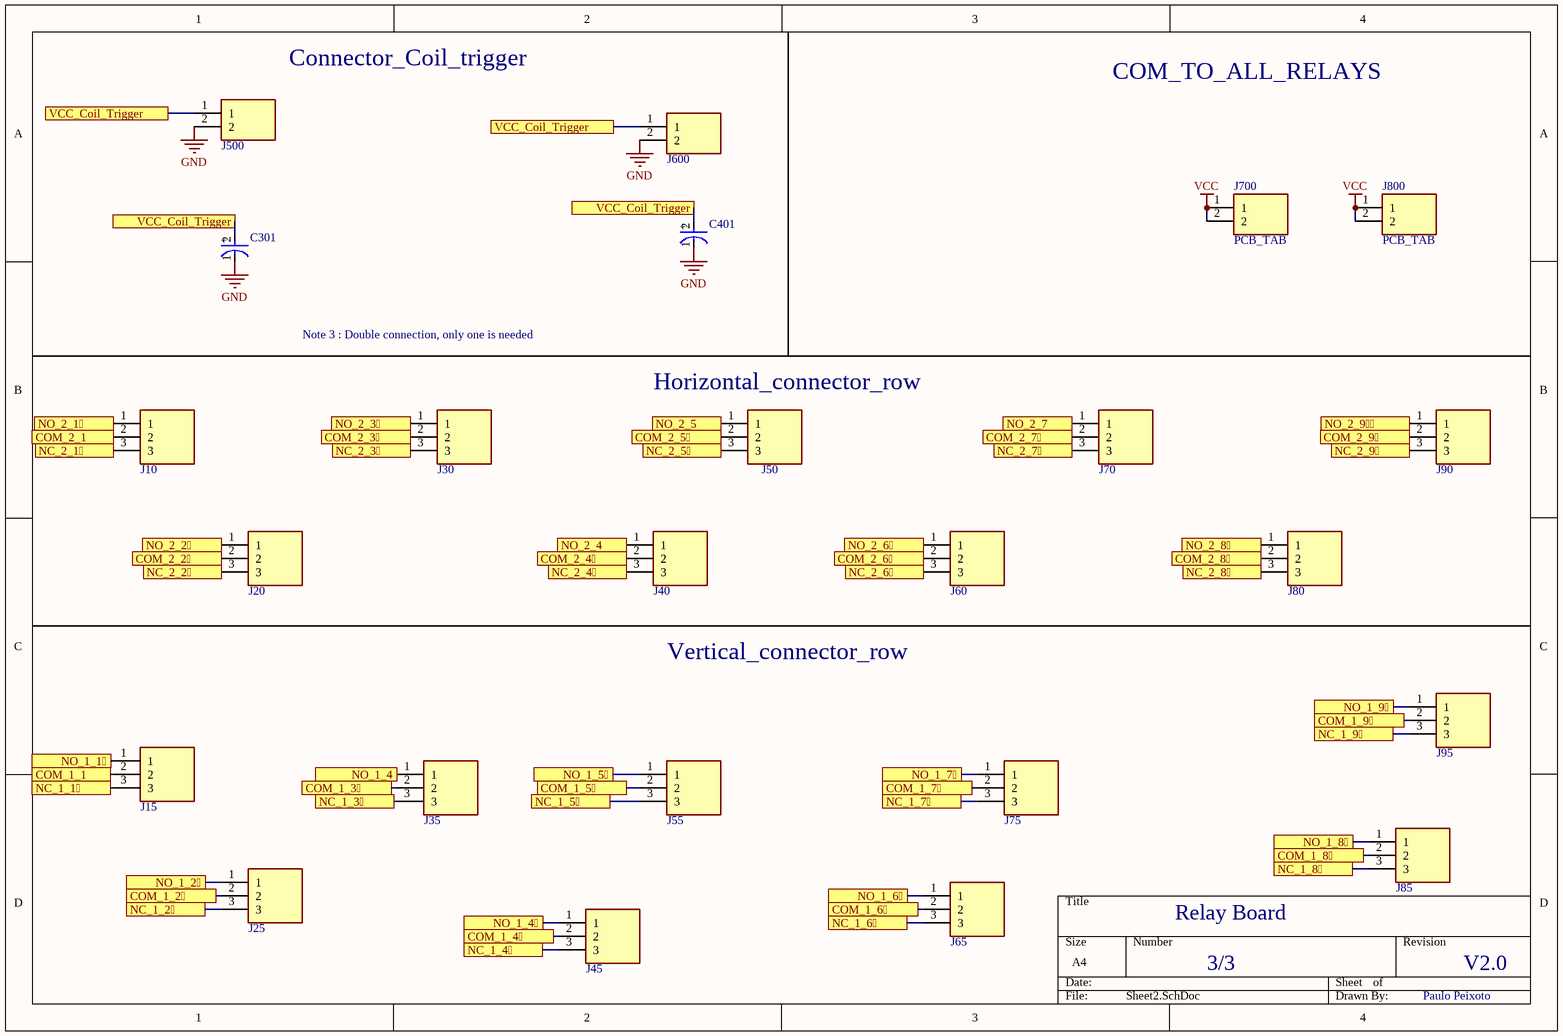
[diagram p2: Sheet2.SchDoc]

### Parts
C301  EEE-FK1H100UR  [FP-FKC-MFG]  (value not drawn)
C401  EEE-FK1H100UR  [FP-FKC-MFG]  (value not drawn)
J10  1546551-3  [Terminal_3p_3.5mm_Horizontal]  (value not drawn)
J15  1546551-3  [Terminal_THT_3p_3.5mm_Vertical]  (value not drawn)
J20  1546551-3  [Terminal_3p_3.5mm_Horizontal]  (value not drawn)
J25  1546551-3  [Terminal_THT_3p_3.5mm_Vertical]  (value not drawn)
J30  1546551-3  [Terminal_3p_3.5mm_Horizontal]  (value not drawn)
J35  1546551-3  [Terminal_THT_3p_3.5mm_Vertical]  (value not drawn)
J40  1546551-3  [Terminal_3p_3.5mm_Horizontal]  (value not drawn)
J45  1546551-3  [Terminal_THT_3p_3.5mm_Vertical]  (value not drawn)
J50  1546551-3  [Terminal_3p_3.5mm_Horizontal]  (value not drawn)
J55  1546551-3  [Terminal_THT_3p_3.5mm_Vertical]  (value not drawn)
J60  1546551-3  [Terminal_3p_3.5mm_Horizontal]  (value not drawn)
J65  1546551-3  [Terminal_THT_3p_3.5mm_Vertical]  (value not drawn)
J70  1546551-3  [Terminal_3p_3.5mm_Horizontal]  (value not drawn)
J75  1546551-3  [Terminal_THT_3p_3.5mm_Vertical]  (value not drawn)
J80  1546551-3  [Terminal_3p_3.5mm_Horizontal]  (value not drawn)
J85  1546551-3  [Terminal_THT_3p_3.5mm_Vertical]  (value not drawn)
J90  1546551-3  [Terminal_3p_3.5mm_Horizontal]  (value not drawn)
J95  1546551-3  [Terminal_THT_3p_3.5mm_Vertical]  (value not drawn)
J500  TB004-508-02BE  [Terminal_TH_2P_3.50]  (value not drawn)
J600  TB004-508-02BE  [Terminal_TH_2P_3.50]  (value not drawn)
J700  PCB_TAB  [PCB_TAB_Vertical_6.35mm]
J800  PCB_TAB  [PCB_TAB_Vertical_6.35mm]

### Ports
COM_1_1 (see Sheet1[2B]), COM_1_2 (see Sheet1[4B]), COM_1_3 (see Sheet1[6B]), COM_1_4 (see Sheet1[2C]), COM_1_5 (see Sheet1[4C]), COM_1_6 (see Sheet1[6C]), COM_1_7 (see Sheet1[2D]), COM_1_8 (see Sheet1[4D]), COM_1_9 (see Sheet1[6D]), COM_2_1 (see Sheet1[2A]), COM_2_2 (see Sheet1[4A]), COM_2_3 (see Sheet1[6A]), COM_2_4 (see Sheet1[2B]), COM_2_5 (see Sheet1[4B]), COM_2_6 (see Sheet1[6B]), COM_2_7 (see Sheet1[2C]), COM_2_8 (see Sheet1[4C]), COM_2_9 (see Sheet1[6C]), NC_1_1 (see Sheet1[2B]), NC_1_2 (see Sheet1[4B]), NC_1_3 (see Sheet1[6B]), NC_1_4 (see Sheet1[2C]), NC_1_5 (see Sheet1[4C]), NC_1_6 (see Sheet1[6C]), NC_1_7 (see Sheet1[2D]), NC_1_8 (see Sheet1[4D]), NC_1_9 (see Sheet1[6D]), NC_2_1 (see Sheet1[2A]), NC_2_2 (see Sheet1[4A]), NC_2_3 (see Sheet1[6A]), NC_2_4 (see Sheet1[2B]), NC_2_5 (see Sheet1[4B]), NC_2_6 (see Sheet1[6B]), NC_2_7 (see Sheet1[2C]), NC_2_8 (see Sheet1[4C]), NC_2_9 (see Sheet1[6C]), NO_1_1 (see Sheet1[2B]), NO_1_2 (see Sheet1[4B]), NO_1_4 (see Sheet1[2C]), NO_1_4 (see Sheet1[6B]), NO_1_5 (see Sheet1[4C]), NO_1_6 (see Sheet1[6C]), NO_1_7 (see Sheet1[2D]), NO_1_8 (see Sheet1[4D]), NO_1_9 (see Sheet1[6D]), NO_2_1 (see Sheet1[2A]), NO_2_2 (see Sheet1[4A]), NO_2_3 (see Sheet1[6A]), NO_2_4 (see Sheet1[2B]), NO_2_5 (see Sheet1[4B]), NO_2_6 (see Sheet1[6B]), NO_2_7 (see Sheet1[2C]), NO_2_8 (see Sheet1[4C]), NO_2_9 (see Sheet1[6C]), VCC_Coil_Trigger (see Sheet1[1A], Sheet1[1C], Sheet1[1D], Sheet1[3A], Sheet1[3C], Sheet1[3D], Sheet1[5A], Sheet1[5C], Sheet1[5D], Sheet2[1A], Sheet2[2A], Sheet4[2B], Sheet4[2C], Sheet4[2D], Sheet4[3B], Sheet4[3C], Sheet4[3D], Sheet4[4B], Sheet4[4C], Sheet4[4D])

### Nets
GND: C301.1(C) C401.1(C) J500.2 J600.2
VCC: J700.1 J700.2 J800.1 J800.2
NetC301_2: C301.2(A) C401.2(A) J500.1 J600.1 ; port VCC_Coil_Trigger
NetG10_11: J15.2 ; port COM_1_1
NetG10_12: J15.3 ; port NC_1_1
NetG10_14: J15.1 ; port NO_1_1
NetG10_21: J10.2 ; port COM_2_1
NetG10_22: J10.3 ; port NC_2_1
NetG10_24: J10.1 ; port NO_2_1
NetG20_11: J25.2 ; port COM_1_2
NetG20_12: J25.3 ; port NC_1_2
NetG20_14: J25.1 ; port NO_1_2
NetG20_21: J20.2 ; port COM_2_2
NetG20_22: J20.3 ; port NC_2_2
NetG20_24: J20.1 ; port NO_2_2
NetG30_11: J35.2 ; port COM_1_3
NetG30_12: J35.3 ; port NC_1_3
NetG30_14: J35.1 ; port NO_1_4
NetG30_21: J30.2 ; port COM_2_3
NetG30_22: J30.3 ; port NC_2_3
NetG30_24: J30.1 ; port NO_2_3
NetG40_11: J45.2 ; port COM_1_4
NetG40_12: J45.3 ; port NC_1_4
NetG40_14: J45.1 ; port NO_1_4
NetG40_21: J40.2 ; port COM_2_4
NetG40_22: J40.3 ; port NC_2_4
NetG40_24: J40.1 ; port NO_2_4
NetG50_11: J55.2 ; port COM_1_5
NetG50_12: J55.3 ; port NC_1_5
NetG50_14: J55.1 ; port NO_1_5
NetG50_21: J50.2 ; port COM_2_5
NetG50_22: J50.3 ; port NC_2_5
NetG50_24: J50.1 ; port NO_2_5
NetG60_11: J65.2 ; port COM_1_6
NetG60_12: J65.3 ; port NC_1_6
NetG60_14: J65.1 ; port NO_1_6
NetG60_21: J60.2 ; port COM_2_6
NetG60_22: J60.3 ; port NC_2_6
NetG60_24: J60.1 ; port NO_2_6
NetG70_11: J75.2 ; port COM_1_7
NetG70_12: J75.3 ; port NC_1_7
NetG70_14: J75.1 ; port NO_1_7
NetG70_21: J70.2 ; port COM_2_7
NetG70_22: J70.3 ; port NC_2_7
NetG70_24: J70.1 ; port NO_2_7
NetG80_11: J85.2 ; port COM_1_8
NetG80_12: J85.3 ; port NC_1_8
NetG80_14: J85.1 ; port NO_1_8
NetG80_21: J80.2 ; port COM_2_8
NetG80_22: J80.3 ; port NC_2_8
NetG80_24: J80.1 ; port NO_2_8
NetG90_11: J95.2 ; port COM_1_9
NetG90_12: J95.3 ; port NC_1_9
NetG90_14: J95.1 ; port NO_1_9
NetG90_21: J90.2 ; port COM_2_9
NetG90_22: J90.3 ; port NC_2_9
NetG90_24: J90.1 ; port NO_2_9

### Notes on the sheet
- Connector_Coil_trigger
- COM_TO_ALL_RELAYS
- Note 3 : Double connection, only one is needed
- (near J50) Horizontal_connector_row
- Vertical_connector_row
- Relay Board
- 3/3
- V2.0
- Paulo Peixoto
- (in symbol CMP-05427-000030-1) +

### Library data of the parts
C301 C401 = CMP-05427-000030-1: as C101 on sheet Sheet4; Length: 5.8mm; Voltage Rating: 50V; Radiation Hardening: No; Max Operating Temperature: 105°C; REACH SVHC: No SVHC; Tolerance: 20%; RoHS Compliant: Yes; Case/Package: Radial; Height: 5.8mm; Voltage: 50V; Diameter: 5mm; Number of Pins: 2; Ripple Current: 85mA; Series: FK; Lead Free: Lead Free; Width: 6.5mm; ESR (Equivalent Series Resistance): 1.52R; Package Quantity: 1000; Construction: Cylindrical; Voltage Rating (DC): 50V; Packaging: Tape and Reel; Height - Seated (Max): 0.228inch; Contact Plating: Tin; Capacitance: 10uF; Min Operating Temperature: -55°C; Termination: SMD/SMT; Material: Aluminium; Mount: Surface Mount
J10 J15 J20 J25 J30 J35 J40 J45 J50 J55 J60 J65 J70 J75 J80 J85 J90 J95 = Con_Terminal_3P: Terminal; Manufacturer_Name: TE Connectivity; Datasheet Link: https://www.te.com/commerce/DocumentDelivery/DDEController?Action=srchrtrv&DocNm=1546551&DocType=Customer+Drawing&DocLang=English&DocFormat=pdf&PartCntxt=1546551-3; Height: 8.5mm; Manufacturer_Part_Number: 1546551-3; Arrow Part Number: 1546551-3; Arrow Price/Stock: https://www.arrow.com/en/products/1546551-3/te-connectivity; Mouser Part Number: 571-1546551-3; Mouser Price/Stock: https://www.mouser.co.uk/ProductDetail/TE-Connectivity/1546551-3?qs=m%2FhmcwQ75LlRawcWGeRFDA%3D%3D
J500 J600 = Con_Terminal_2P: as J100 on sheet Sheet4; Datasheet Link: https://componentsearchengine.com/Datasheets/1/TB004-508-02BE.pdf; Height: 14.1mm; Manufacturer_Part_Number: TB004-508-02BE; Arrow Part Number: TB004-508-02BE; Arrow Price/Stock: https://www.arrow.com/en/products/tb004-508-02be/cui-inc; Mouser Part Number: 490-TB004-508-02BE; Mouser Price/Stock: https://www.mouser.co.uk/ProductDetail/CUI-Devices/TB004-508-02BE?qs=vLWxofP3U2zLwdGzG2tSkA%3D%3D

## Nets that join several sheets
GND: Sheet1 (9 pins), Sheet2 (C301.1 C401.1 J500.2 J600.2)
NetC301_2: Sheet4 (9 pins), Sheet1 (18 pins), Sheet2 (C301.2 C401.2 J500.1 J600.1)
NetG10_11: Sheet1 (G10.11), Sheet2 (J15.2)
NetG10_12: Sheet1 (G10.12), Sheet2 (J15.3)
NetG10_14: Sheet1 (G10.14), Sheet2 (J15.1)
NetG10_21: Sheet1 (G10.21), Sheet2 (J10.2)
NetG10_22: Sheet1 (G10.22), Sheet2 (J10.3)
NetG10_24: Sheet1 (G10.24), Sheet2 (J10.1)
NetG20_11: Sheet1 (G20.11), Sheet2 (J25.2)
NetG20_12: Sheet1 (G20.12), Sheet2 (J25.3)
NetG20_14: Sheet1 (G20.14), Sheet2 (J25.1)
NetG20_21: Sheet1 (G20.21), Sheet2 (J20.2)
NetG20_22: Sheet1 (G20.22), Sheet2 (J20.3)
NetG20_24: Sheet1 (G20.24), Sheet2 (J20.1)
NetG30_11: Sheet1 (G30.11), Sheet2 (J35.2)
NetG30_12: Sheet1 (G30.12), Sheet2 (J35.3)
NetG30_14: Sheet1 (G30.14), Sheet2 (J35.1)
NetG30_21: Sheet1 (G30.21), Sheet2 (J30.2)
NetG30_22: Sheet1 (G30.22), Sheet2 (J30.3)
NetG30_24: Sheet1 (G30.24), Sheet2 (J30.1)
NetG40_11: Sheet1 (G40.11), Sheet2 (J45.2)
NetG40_12: Sheet1 (G40.12), Sheet2 (J45.3)
NetG40_14: Sheet1 (G40.14), Sheet2 (J45.1)
NetG40_21: Sheet1 (G40.21), Sheet2 (J40.2)
NetG40_22: Sheet1 (G40.22), Sheet2 (J40.3)
NetG40_24: Sheet1 (G40.24), Sheet2 (J40.1)
NetG50_11: Sheet1 (G50.11), Sheet2 (J55.2)
NetG50_12: Sheet1 (G50.12), Sheet2 (J55.3)
NetG50_14: Sheet1 (G50.14), Sheet2 (J55.1)
NetG50_21: Sheet1 (G50.21), Sheet2 (J50.2)
NetG50_22: Sheet1 (G50.22), Sheet2 (J50.3)
NetG50_24: Sheet1 (G50.24), Sheet2 (J50.1)
NetG60_11: Sheet1 (G60.11), Sheet2 (J65.2)
NetG60_12: Sheet1 (G60.12), Sheet2 (J65.3)
NetG60_14: Sheet1 (G60.14), Sheet2 (J65.1)
NetG60_21: Sheet1 (G60.21), Sheet2 (J60.2)
NetG60_22: Sheet1 (G60.22), Sheet2 (J60.3)
NetG60_24: Sheet1 (G60.24), Sheet2 (J60.1)
NetG70_11: Sheet1 (G70.11), Sheet2 (J75.2)
NetG70_12: Sheet1 (G70.12), Sheet2 (J75.3)
NetG70_14: Sheet1 (G70.14), Sheet2 (J75.1)
NetG70_21: Sheet1 (G70.21), Sheet2 (J70.2)
NetG70_22: Sheet1 (G70.22), Sheet2 (J70.3)
NetG70_24: Sheet1 (G70.24), Sheet2 (J70.1)
NetG80_11: Sheet1 (G80.11), Sheet2 (J85.2)
NetG80_12: Sheet1 (G80.12), Sheet2 (J85.3)
NetG80_14: Sheet1 (G80.14), Sheet2 (J85.1)
NetG80_21: Sheet1 (G80.21), Sheet2 (J80.2)
NetG80_22: Sheet1 (G80.22), Sheet2 (J80.3)
NetG80_24: Sheet1 (G80.24), Sheet2 (J80.1)
NetG90_11: Sheet1 (G90.11), Sheet2 (J95.2)
NetG90_12: Sheet1 (G90.12), Sheet2 (J95.3)
NetG90_14: Sheet1 (G90.14), Sheet2 (J95.1)
NetG90_21: Sheet1 (G90.21), Sheet2 (J90.2)
NetG90_22: Sheet1 (G90.22), Sheet2 (J90.3)
NetG90_24: Sheet1 (G90.24), Sheet2 (J90.1)
NetQ10_3: Sheet4 (Q10.3), Sheet1 (R13.2)
NetQ20_3: Sheet4 (Q20.3), Sheet1 (R23.2)
NetQ30_3: Sheet4 (Q30.3), Sheet1 (R33.2)
NetQ40_3: Sheet4 (Q40.3), Sheet1 (R43.2)
NetQ50_3: Sheet4 (Q50.3), Sheet1 (R53.2)
NetQ60_3: Sheet4 (Q60.3), Sheet1 (R63.2)
NetQ70_3: Sheet4 (Q70.3), Sheet1 (R73.2)
NetQ80_3: Sheet4 (Q80.3), Sheet1 (R83.2)
NetQ90_3: Sheet4 (Q90.3), Sheet1 (R93.2)